# Altium project Project.PrjPCB
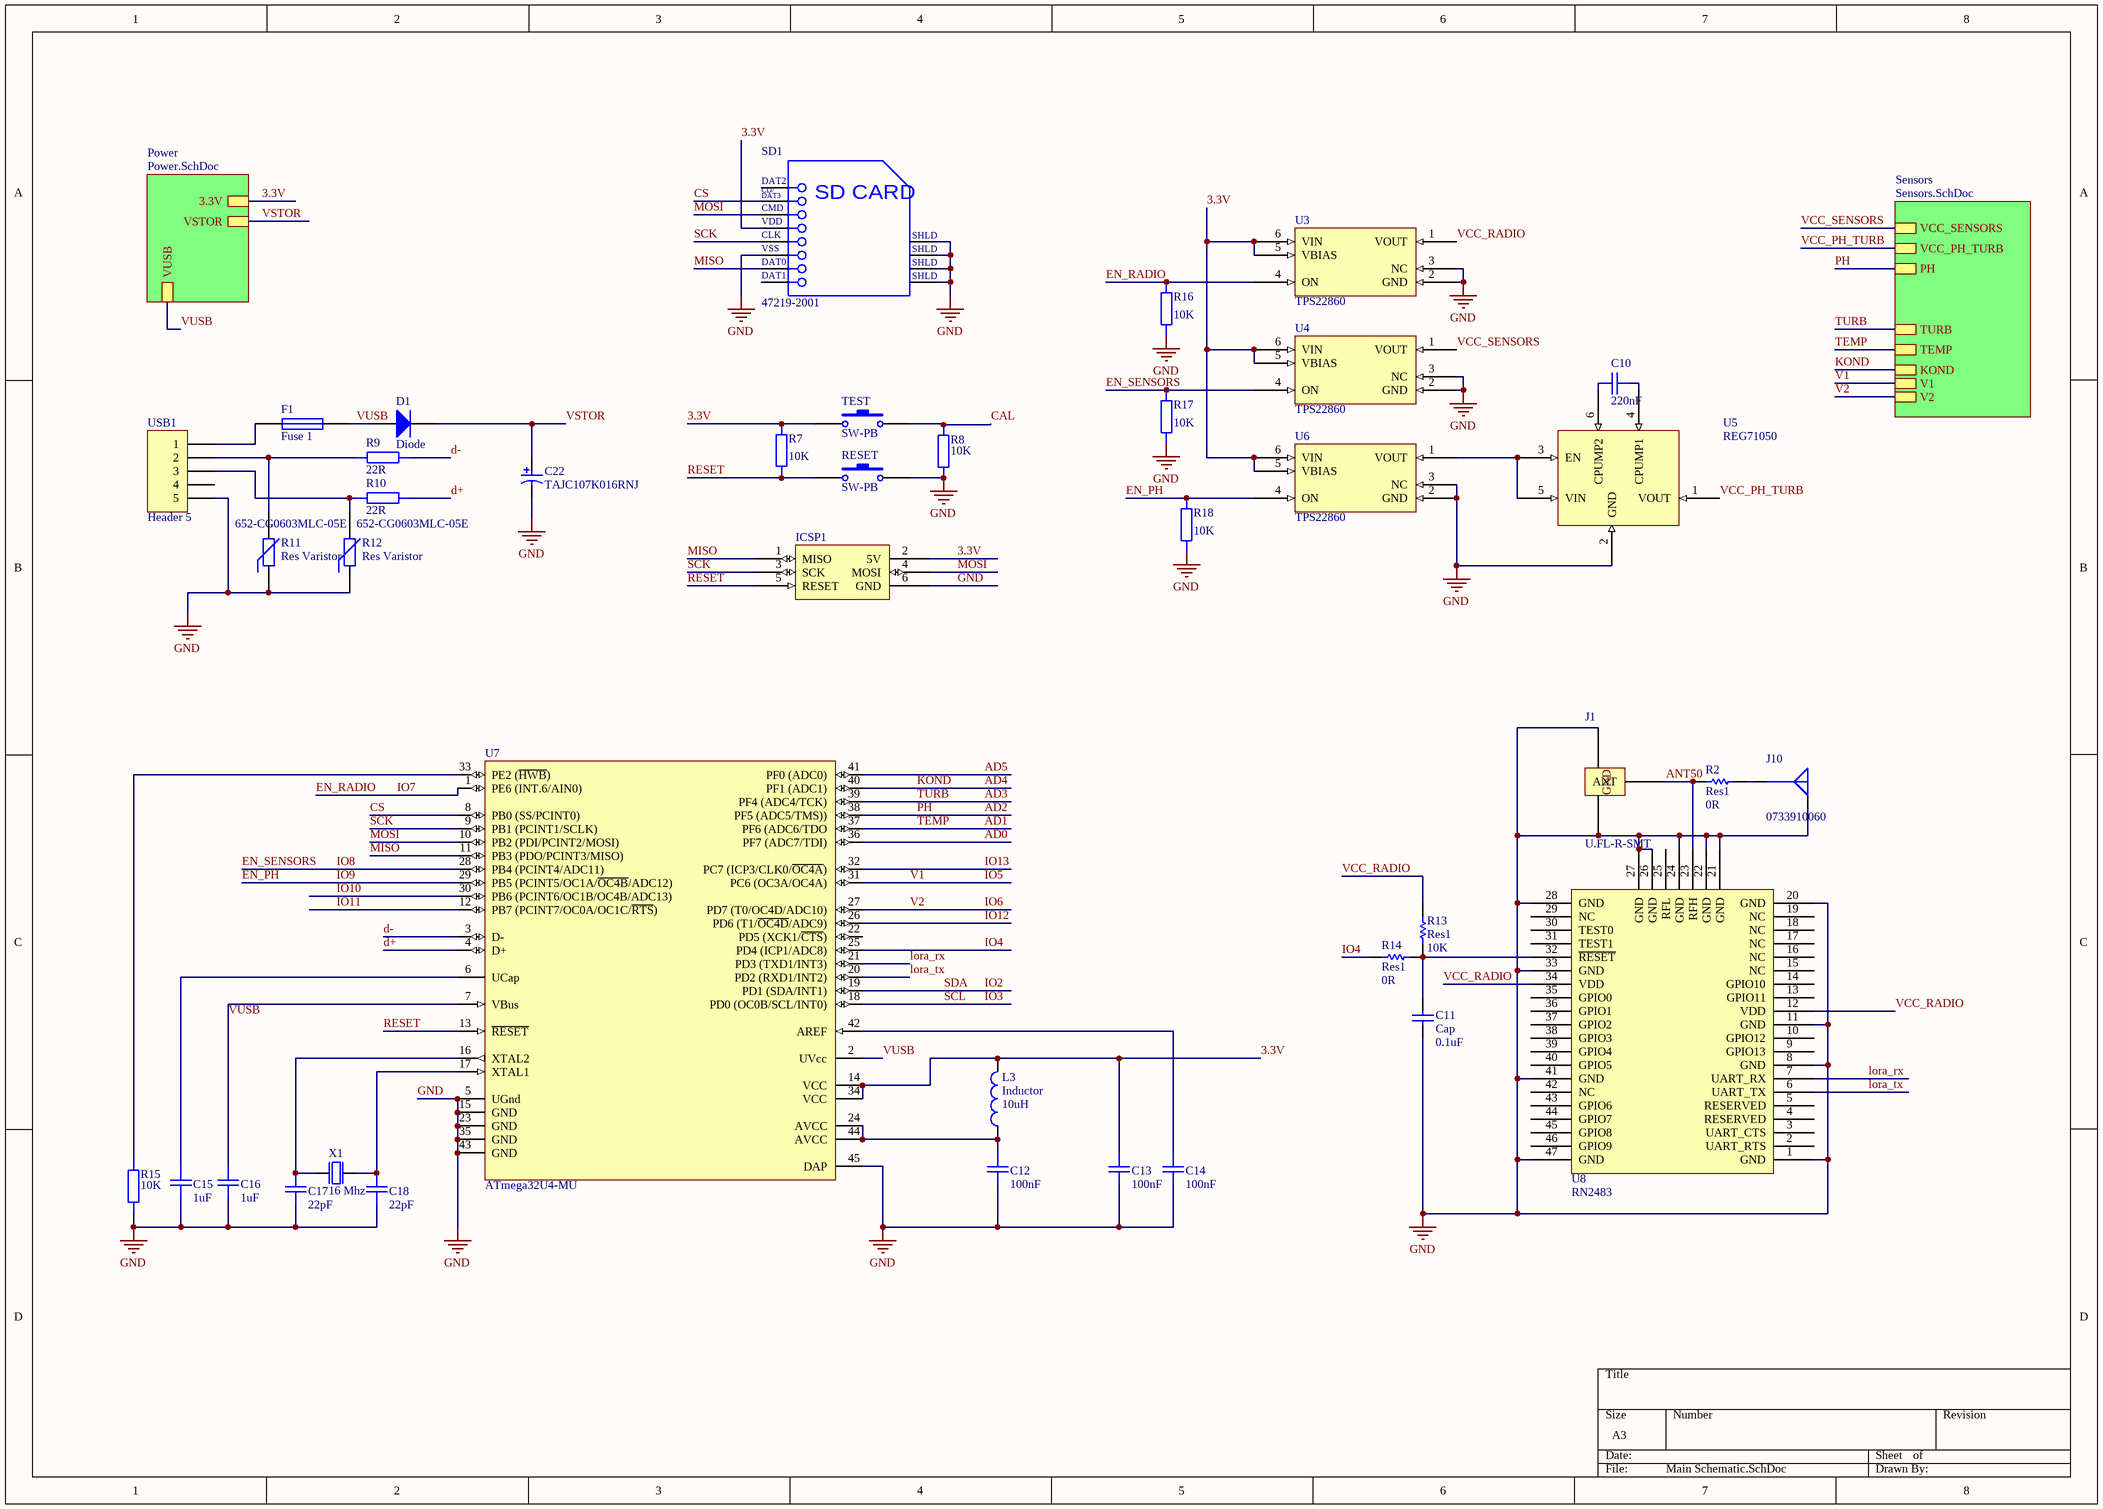
[diagram p0: Main Schematic.SchDoc]
4 sheets, 105 parts. Net scope: hierarchical (ports join the sheet entries above them; power ports are global).
Board files: PCB.PcbDoc, Opamp.PcbDoc
Sheets:
  Main Schematic.SchDoc
    Sensors = Sensors.SchDoc
    Power = Power.SchDoc
  Opamp.SchDoc

## Sheet Main Schematic.SchDoc
size A3

### Parts
C10  value 220nF  [C0805]  (hidden comment: Capacitor)
C11  Cap  value 0.1uF  [C0805]
C12  value 100nF  [C0805]  (hidden comment: Capacitor)
C13  value 100nF  [C0805]  (hidden comment: Capacitor)
C14  value 100nF  [C0805]  (hidden comment: Capacitor)
C15  value 1uF  [C0805]  (hidden comment: Capacitor)
C16  value 1uF  [C0805]  (hidden comment: Capacitor)
C17  value 22pF  [C0805]  (hidden comment: Capacitor)
C18  value 22pF  [C0805]  (hidden comment: Capacitor)
C22  TAJC107K016RNJ  [AVX-TAJ-C-2_M]
D1  Diode  [3216[1206]]
F1  Fuse 1  [1812]
ICSP1  ICSP  [ICSP]  (value not drawn)
J1  U.FL-R-SMT  [U.FL-R-SMT]
J10  0733910060  [MOLEX SD-73391-0060]
L3  Inductor  value 10uH  [C0603]
R2  Res1  value 0R  [6-0805_L]
R7  value 10K  [6-0805_L]  (hidden comment: Resistor)
R8  value 10K  [6-0805_L]  (hidden comment: Resistor)
R9  value 22R  [6-0805_L]  (hidden comment: Resistor)
R10  value 22R  [6-0805_L]  (hidden comment: Resistor)
R11  Res Varistor  Supplier Part Number 1: 652-CG0603MLC-05E  [6-0805_L]
R12  Res Varistor  Supplier Part Number 1: 652-CG0603MLC-05E  [6-0805_L]
R13  Res1  value 10K  [6-0805_L]
R14  Res1  value 0R  [6-0805_L]
R15  value 10K  [6-0805_L]  (hidden comment: Resistor)
R16  value 10K  [6-0805_L]  (hidden comment: Resistor)
R17  value 10K  [6-0805_L]  (hidden comment: Resistor)
R18  value 10K  [6-0805_L]  (hidden comment: Resistor)
RESET  SW-PB  [BUTTON]
SD1  47219-2001  [MOLX-47219-2001-8_V]
TEST  SW-PB  [BUTTON]
U3  TPS22860  [DBV PSOP]
U4  TPS22860  [DBV PSOP]
U5  REG71050  [DBV PSOP]
U6  TPS22860  [DBV PSOP]
U7  ATmega32U4-MU  [TQFP44]
U8  RN2483  [RN2483 - duplicate]
USB1  Header 5  [10118193-0001LF]
X1  16 Mhz  [XTAL CSM-3X]

### Sub-sheets
Power = Power.SchDoc: 3.3V, VUSB, VSTOR
Sensors = Sensors.SchDoc: KOND, PH, VCC_SENSORS, V2, V1, TURB, TEMP, VCC_PH_TURB

### Nets
GND: C11.2 C12.2 C13.2 C14.2 C15.2 C16.2 C17.2 C18.2 C22.2 ICSP1.6(GND) J1.2(GND) J1.3(GND) J10.G R8.2 R11.1 R12.1 R15.2 R16.2 R17.2 R18.2 RESET.2 SD1.6(VSS) SD1.9(SHLD) SD1.10(SHLD) SD1.11(SHLD) SD1.12(SHLD) U3.2(GND) U3.3(NC) U4.2(GND) U4.3(NC) U5.2(GND) U6.2(GND) U6.3(NC) U7.5(UGnd) U7.15(GND) U7.23(GND) U7.35(GND) U7.43(GND) U7.45(DAP) U8.1(GND) U8.8(GND) U8.11(GND) U8.20(GND) U8.21(GND) U8.22(GND) U8.24(GND) U8.26(GND) U8.27(GND) U8.28(GND) U8.33(GND) U8.41(GND) U8.47(GND) USB1.5
3.3V: C13.1 ICSP1.2(5V) L3.1 R7.1 SD1.4(VDD) TEST.1 U3.5(VBIAS) U3.6(VIN) U4.5(VBIAS) U4.6(VIN) U6.5(VBIAS) U6.6(VIN) U7.14(VCC) U7.34(VCC) ; sheet Power/3.3V
AD0: U7.36(PF7_(ADC7/TDI))
AD1: U7.37(PF6_(ADC6/TDO) ; sheet Sensors/TEMP  [also labelled TEMP]
AD2: U7.38(PF5_(ADC5/TMS))) ; sheet Sensors/PH  [also labelled PH]
AD3: U7.39(PF4_(ADC4/TCK)) ; sheet Sensors/TURB  [also labelled TURB]
AD4: U7.40(PF1_(ADC1)) ; sheet Sensors/KOND  [also labelled KOND]
AD5: U7.41(PF0_(ADC0))
ANT50: J1.1(ANT) R2.1 U8.23(RFH)
CAL: R8.1 TEST.2
CS: SD1.2(CD/DAT3) U7.8(PB0_(SS/PCINT0))
d+: R10.2 U7.4(D+)
d-: R9.2 U7.3(D-)
EN_PH: R18.1 U6.4(ON) U7.29(PB5_(PCINT5/OC1A/~{OC4B}/ADC12))  [also labelled IO9]
EN_RADIO: R16.1 U3.4(ON) U7.1(PE6_(INT.6/AIN0))  [also labelled IO7]
EN_SENSORS: R17.1 U4.4(ON) U7.28(PB4_(PCINT4/ADC11))  [also labelled IO8]
IO2: U7.19(PD1_(SDA/INT1))  [also labelled SDA]
IO3: U7.18(PD0_(OC0B/SCL/INT0))  [also labelled SCL]
IO4: R14.1 U7.25(PD4_(ICP1/ADC8))
IO5: U7.31(PC6_(OC3A/OC4A)) ; sheet Sensors/V1  [also labelled V1]
IO6: U7.27(PD7_(T0/OC4D/ADC10)) ; sheet Sensors/V2  [also labelled V2]
IO10: U7.30(PB6_(PCINT6/OC1B/OC4B/ADC13))
IO11: U7.12(PB7_(PCINT7/OC0A/OC1C/~{RTS}))
IO12: U7.26(PD6_(T1/~{OC4D}/ADC9))
IO13: U7.32(PC7_(ICP3/CLK0/~{OC4A}))
lora_rx: U7.21(PD3_(TXD1/INT3)) U8.7(UART_RX)
lora_tx: U7.20(PD2_(RXD1/INT2)) U8.6(UART_TX)
MISO: ICSP1.1(MISO) SD1.7(DAT0) U7.11(PB3_(PDO/PCINT3/MISO))
MOSI: ICSP1.4(MOSI) SD1.3(CMD) U7.10(PB2_(PDI/PCINT2/MOSI))
RESET: ICSP1.5(RESET) R7.2 RESET.1 U7.13(~{RESET})
SCK: ICSP1.3(SCK) SD1.5(CLK) U7.9(PB1_(PCINT1/SCLK))
VCC_PH_TURB: U5.1(VOUT) ; sheet Sensors/VCC_PH_TURB
VCC_RADIO: R13.1 U3.1(VOUT) U8.12(VDD) U8.34(VDD)
VCC_SENSORS: U4.1(VOUT) ; sheet Sensors/VCC_SENSORS
VSTOR: C22.1 D1.2(K) ; sheet Power/VSTOR
VUSB: C16.1 D1.1(A) F1.2 U7.2(UVcc) U7.7(VBus) ; sheet Power/VUSB  [project net ~{EN}]
NetC10_1: C10.1 U5.6(CPUMP2)
NetC10_2: C10.2 U5.4(CPUMP1)
NetC11_1: C11.1 R13.2 R14.2 U8.32(~{RESET})
NetC12_1: C12.1 L3.2 U7.24(AVCC) U7.44(AVCC)
NetC14_1: C14.1 U7.42(AREF)
NetC15_1: C15.1 U7.6(UCap)
NetC17_1: C17.1 U7.16(XTAL2) X1.1(inp)
NetC18_1: C18.1 U7.17(XTAL1) X1.2(out)
NetF1_1: F1.1 USB1.1
NetJ10_S: J10.S R2.2
NetR9_1: R9.1 R11.2 USB1.2
NetR10_1: R10.1 R12.2 USB1.3
NetR15_1: R15.1 U7.33(PE2_(~{HWB}))
NetU5_3: U5.3(EN) U5.5(VIN) U6.1(VOUT)

Not connected (* = marked no-connect by the designer): SD1 1(DAT2) 8(DAT1); U7 22(PD5_(XCK1/~{CTS})); U8 2(UART_RTS) 3(UART_CTS) 4(RESERVED) 5(RESERVED) 9(GPIO13) 10(GPIO12) 13(GPIO11) 14(GPIO10) 15(NC) 16(NC) 17(NC) 18(NC) 19(NC) 25(RFL) 29(NC) 30(TEST0) 31(TEST1) 35(GPIO0) 36(GPIO1) 37(GPIO2) 38(GPIO3) 39(GPIO4) 40(GPIO5) 42(NC) 43(GPIO6) 44(GPIO7) 45(GPIO8) 46(GPIO9); USB1 4

### Notes on the sheet
- (in symbol CMP-2000-05245-1) CD/; DAT3; SD CARD

### Library data of the parts
C10 C12-C18 = Capacitor: Voltage: 16V; Tolerance: 10%; Package: 0603
C11 = Cap: Capacitor; Published: 8-Jun-2000; LatestRevisionDate: 17-Jul-2002; LatestRevisionNote: Re-released for DXP Platform.; PackageReference: RAD-0.3; Publisher: Altium Limited; PackageDescription: Radial Cap, Thru-Hole; 2 Leads; 0.3 in Pin Spacing
C22 = CMP-2100-03691-1: Standard Tantalum, 100 uF, +/- 10%, 16 V, -55 to 125 degC, 2-Pin SMD (2312), RoHS, Tape and Reel; Manufacturer: AVX; Resistance: 1Ohm; Dissipation Factor: 8%; Voltage Rating: 16V; Polarity: Polar; Capacitance: 100uF; Leakage Current: 16uA; Datasheet URL: http://datasheets.avx.com/TAJ.pdf; Package Description: 2-Pin Surface Mount Device, Body 6 x 3.25 mm; Case/Package: Molded; Case Code (Metric): 6032; Number of Pins: 2; Tolerance: 10%; Length: 6mm; Width: 3.2mm; Height: 2.8mm; Height - Seated (Max): 0.11inch; Min Operating Temperature: -55degC; Termination: SMD/SMT; Voltage Rating (DC): 16V; Max Operating Temperature: 125degC; Package Quantity: 1; Manufacturer URL: http://www.avx.com/; RoHSCompliant: True; ESR (Equivalent Series Resistance): 1Ohm; Packaging: TapeandReel; Radiation Hardening: No; Lead Free: LeadFree; Case Code (Imperial): 2412; Depth: 3.2mm; Datasheet Version: 42401.0; Package Reference: TAJ-C-2; REACH SVHC: NoSVHC
D1 = Diode: Default Diode; Published: 8-Jun-2000; LatestRevisionDate: 17-Jul-2002; LatestRevisionNote: Re-released for DXP Platform.; PackageVersion: Sep-1996; PackageReference: SMC; Publisher: Altium Limited; PackageDescription: DO-214-AB/SMC; 2 C-Bend Leads; Body 7.9 x 5.9 mm, inc. leads (LxW); Code_JEDEC: DO-214-AB
F1 = Fuse 1: Fuse; Published: 8-Jun-2000; LatestRevisionDate: 17-Jul-2002; LatestRevisionNote: Re-released for DXP Platform.; PackageReference: PIN-W2/E2.8; Publisher: Altium Limited; PackageDescription: Thru-Hole; 2 Leads
J10 = 0733910060: CONN SMA JACK STR 50 OHM PCB; Part Number: 0733910060
L3 = Inductor: Code_IEC: 1005; Published: 8-Jun-2000; LatestRevisionDate: 29-May-2009; LatestRevisionNote: IPC-7351 Footprint Added.; PackageReference: 0402-A; Publisher: Altium Limited; PackageDescription: Chip Inductor; Code_JEITA: 0402
R2 R13 R14 = Res1: Resistor; Published: 8-Jun-2000; LatestRevisionDate: 17-Jul-2002; LatestRevisionNote: Re-released for DXP Platform.; PackageReference: AXIAL-0.3; Publisher: Altium Limited; PackageDescription: Axial Device, Thru-Hole; 2 Leads; 0.3 in Pin Spacing
R7-R10 R15-R18 = Resistor: Tolerance: 1%; Power Rating: 1/4W; Package: 0602
R11 R12 = Res Varistor: Varistor (Voltage-Sensitive Resistor); Manufacturer: Bourns; Manufacturer Part Number: CG0603MLC-05E; Capacitance: 0.5pF; Voltage Rating (DC): 5V; Voltage Rating (AC): 8V; Number of Channels: 1; Clamping Voltage: 20V; Current Rating: 50nA; Turn-On Delay Time: 1ns; Element Configuration: Single; Published: 24-Mar-1999; LatestRevisionDate: 29-May-2009; LatestRevisionNote: IPC-7351 Footprint Added.; PackageVersion: Mar-2003; PackageReference: 6-0805; Publisher: Altium Limited; PackageDescription: Chip Resistor 0805 Case Size; Code_IPC: RESC2012; Supplier 1: Mouser; Stock 1: 88623; Pricing 1: 1=0.51, 10=0.294, 50=0.294, 100=0.171, 1000=0.107, 10000=0.08 (USD); Case/Package: 0603; Number of Pins: 2; Case Code (Imperial): 0603; Case Code (Metric): 1608; Contact Plating: Tin; Min Operating Temperature: -40°C; Max Operating Temperature: 85°C; Operating Supply Voltage: 5V; Package Quantity: 1; Packaging: Tape and Reel; Termination: SMD/SMT; Voltage: 5V; Number of Circuits: 1; Max Voltage Rating (DC): 5V; Working Voltage: 5V; Leakage Current: 50nA; Length: 1.6mm; Width: 0.8mm; Depth: 0.8mm; Thickness: 0.8mm; Radiation Hardening: No; REACH SVHC: No SVHC; ComponentLink1URL: https://www.bourns.com/docs/Product-Datasheets/MLC.pdf; ComponentLink1Description: https://www.bourns.com/docs/Product-Datasheets/MLC.pdf; ComponentLink2URL: http://www.farnell.com/datasheets/1785244.pdf; ComponentLink2Description: http://www.farnell.com/datasheets/1785244.pdf; ComponentLink3URL: http://www.jameco.com/Jameco/Products/ProdDS/1163231.pdf; ComponentLink3Description: http://www.jameco.com/Jameco/Products/ProdDS/1163231.pdf; ComponentLink4URL: http://www.bourns.com/docs/Product-Datasheets/MLC.pdf; ComponentLink4Description: http://www.bourns.com/docs/Product-Datasheets/MLC.pdf
RESET TEST = SW-PB: Switch; Published: 24-Mar-1999; LatestRevisionDate: 17-Jul-2002; LatestRevisionNote: Re-released for DXP Platform.; PackageReference: SPST-2; Publisher: Altium Limited; PackageDescription: Switch; 2 Leads
SD1 = CMP-2000-05245-1: MicroSD Card Connector, Hinge Type, -40 to 85 degC, 8-Pin SMD, RoHS, Tape and Reel; Manufacturer: Molex; Current Rating: 500mA; Number of Contacts: 8; Pitch: 1.09mm; Insertion - Extraction Style: Hinged; Voltage Rating: 100VDC; Product: CardConnectors; Contact Material: CopperAlloy; Series: 47219; Packaging: Reel; Brand: Molex; Product Category: MemoryCardConnectors; Housing Material: Thermoplastic; Mounting Style: SMD/SMT; Termination Style: SMD; Datasheet Version: Rev. F, 06/2009; Card Type: microSD; Manufacturer URL: http://www.molex.com/; RoHS: Details; Datasheet URL: http://www.molex.com/pdm_docs/sd/472192001_sd.pdf; Factory Pack Quantity: 2400
U3 U4 U6 = TPS22860: Load switch; ComponentLink1Description: datasheet; ComponentLink1URL: http://www.ti.com/lit/ds/symlink/tps22860.pdf
U5 = REG71050: Reguator 5V
U7 = ATmega32U4-MU: 8-bit AVR Microcontroller, 2.7-5.5V, 32KB Flash, 2.5KB EEPROM, 1KB SRAM, USB Controller, 44-pin QFN, Industrial Grade (-40°C to 85°C); pin to pad: 45>43; Published: 1-Apr-2010; DatasheetVersion: revD, Jan-2009; PackageVersion: revF, Jul-2007; PackageReference: 44PW; Publisher: Altium Limited; PackageDescription: 44-Pin Quad Flat No-Lead Package, 7 x 7 mm Body, 0.5 mm Pitch (QFN); Supplier 1: Digi-Key; Supplier Part Number 1: ATMEGA32U4-MU-ND; Supplier 2: Mouser; Supplier Part Number 2: 556-ATMEGA32U4-MU; Code_JEDEC: MO-220-VKKD-1; ComponentLink1Description: Manufacturer Link; ComponentLink1URL: http://www.atmel.com/products/avr/default.asp?; ComponentLink2Description: ATmega16U4/32U4 Datasheet; ComponentLink2URL: http://www.atmel.com/dyn/resources/prod_documents/doc7766.pdf; ComponentLink3Description: ATmega16U4 ATmega32U4 Summary; ComponentLink3URL: http://www.atmel.com/dyn/resources/prod_documents/7766S.pdf; ComponentLink4Description: Atmel.com Home; ComponentLink4URL: http://www.atmel.com
USB1 = Header 5: Header, 5-Pin; LatestRevisionDate: 17-Jul-2002; LatestRevisionNote: Re-released for DXP Platform.; Publisher: Altium Limited
X1 = NX2520SA-16MHZ-STD-CSW-5: XTAL SMD 2520, 16MHz, 8pF, ±15ppm; Manufacturer: NDK; Value: 8MHz; Note: XTAL SMD 16.000MHz; Artikkelnr Noca: 22019192; Artikkelnr Simpro: N.A.; Part Number: NX2520SA-16MHZ-STD-CSW-5; Manufacturer Part Number: NX2520SA-16MHZ-STD-CSW-5; Datasheet: http://www.ndk.com/images/products/catalog/c_NX2520SA-STD-CSW-5_e.pdf; LatestRevisionDate: 2012-06-15; Pin Count: 4; Publisher: Nordic Semiconductor; Published: 2012-06-15; Supplier: Digi-Key; Supplier part number: 644-1169-1-ND; 2nd source Supplier: *; 2nd source part number: *; Footprint Doc: BT-XTAL_2520

## Sheet Sensors.SchDoc
size A4
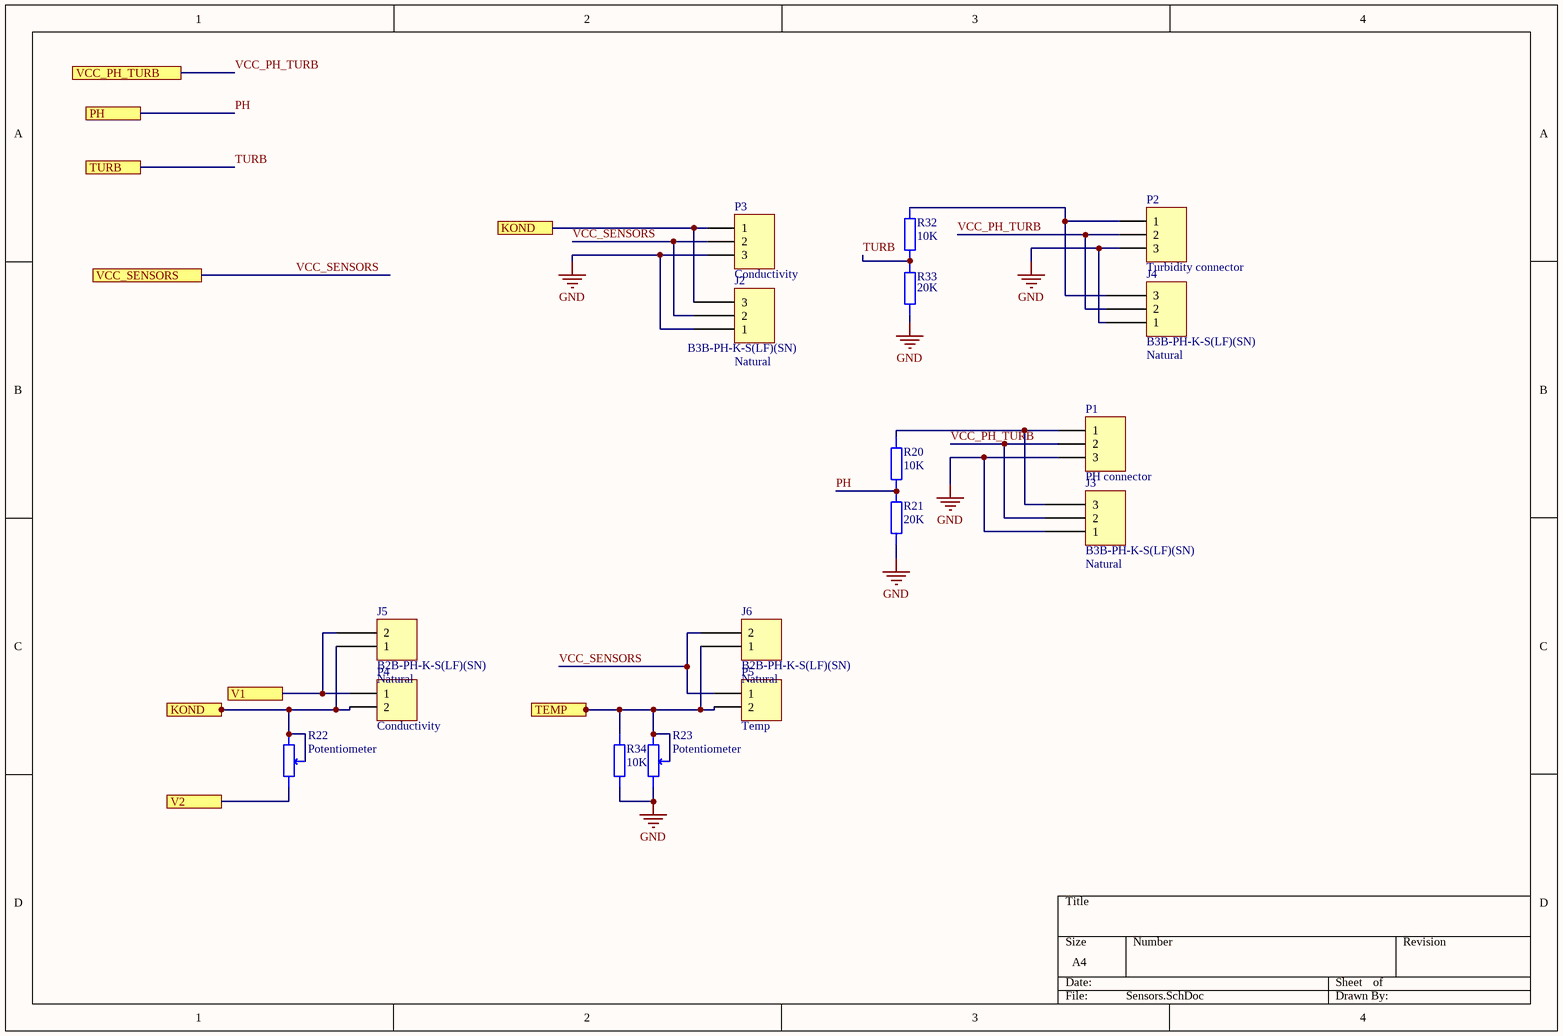
[diagram p1: Sensors.SchDoc]

### Parts
J2  B3B-PH-K-S(LF)(SN)  Colour: Natural  [JST B3B-PH-K]
J3  B3B-PH-K-S(LF)(SN)  Colour: Natural  [JST B3B-PH-K]
J4  B3B-PH-K-S(LF)(SN)  Colour: Natural  [JST B3B-PH-K]
J5  B2B-PH-K-S(LF)(SN)  Colour: Natural  [JST B2B-PH-K]
J6  B2B-PH-K-S(LF)(SN)  Colour: Natural  [JST B2B-PH-K]
P1  PH connector  [HDR1X3]
P2  Turbidity connector  [HDR1X3]
P3  Conductivity  [HDR1X3]
P4  Conductivity  [HDR1X2]
P5  Temp  [HDR1X2]
R20  value 10K  [6-0805_L]  (hidden comment: Resistor)
R21  value 20K  [6-0805_L]  (hidden comment: Resistor)
R22  Potentiometer  [Trimmer]
R23  Potentiometer  [Trimmer]
R32  value 10K  [6-0805_L]  (hidden comment: Resistor)
R33  value 20K  [6-0805_L]  (hidden comment: Resistor)
R34  value 10K  [6-0805_L]  (hidden comment: Resistor)

### Ports
KOND, PH, TEMP, TURB, V1, V2, VCC_PH_TURB, VCC_SENSORS

### Nets
GND: J2.1 J3.1 J4.1 P1.3 P2.3 P3.3 R21.2 R23.2 R33.2 R34.2
AD1: J6.1 P5.2 R23.1 R23.3 R34.1 ; port TEMP
AD4: J2.3 J5.1 P3.1 P4.2 R22.1 R22.3 ; port KOND
IO5: J5.2 P4.1 ; port V1
IO6: R22.2 ; port V2
PH: R20.2 R21.1 ; port PH  [project net AD2]
TURB: R32.2 R33.1 ; port TURB  [project net AD3]
VCC_PH_TURB: J3.2 J4.2 P1.2 P2.2 ; port VCC_PH_TURB
VCC_SENSORS: J2.2 J6.2 P3.2 P5.1 ; port VCC_SENSORS
NetJ3_3: J3.3 P1.1 R20.1
NetJ4_3: J4.3 P2.1 R32.1

### Library data of the parts
J2-J4 = B3B-PH-K-S(LF)(SN): CONN HEADER PH TOP 3POS 2MM; Manufacturer: JST Sales America Inc.; Pitch: 0.079" (2.00mm); Number Of Positions: 3; Part Number: B3B-PH-K-S(LF)(SN); PartId: 29448; Supplier 1: Digi-Key; Supplier Part Number 1: 455-1705-ND; ComponentLink1Description: Datasheet; ComponentLink1URL: http://www.jst-mfg.com/product/pdf/eng/ePH.pdf; ComponentLink2Description: Digi-Key Listing; ComponentLink2URL: http://www.digikey.com/product-detail/en/jst-sales-america-inc/B3B-PH-K-S(LF)(SN)/455-1705-ND/926612; Price: 0,19; Type: Header, Shrouded; Contact Finish: Tin; Fastening Type: Detent Lock; Number Of Rows: 1; Series: PH
J5 J6 = B2B-PH-K-S(LF)(SN): CONN HEADER PH TOP 2POS 2MM; Manufacturer: JST Sales America Inc.; Pitch: 0.079" (2.00mm); Number Of Positions: 2; Part Number: B2B-PH-K-S(LF)(SN); PartId: 29447; Supplier 1: Digi-Key; Supplier Part Number 1: 455-1704-ND; ComponentLink1Description: Datasheet; ComponentLink1URL: http://www.jst-mfg.com/product/pdf/eng/ePH.pdf; ComponentLink2Description: Digi-Key Listing; ComponentLink2URL: http://www.digikey.com/product-detail/en/jst-sales-america-inc/B2B-PH-K-S(LF)(SN)/455-1704-ND/926611; Price: 0,17; Type: Header, Shrouded; Contact Finish: Tin; Fastening Type: Detent Lock; Number Of Rows: 1; Series: PH
P1-P3 = Header 3: Header, 3-Pin; LatestRevisionDate: 17-Jul-2002; LatestRevisionNote: Re-released for DXP Platform.; Publisher: Altium Limited
P4 P5 = Header 2: Header, 2-Pin; LatestRevisionDate: 17-Jul-2002; LatestRevisionNote: Re-released for DXP Platform.; Publisher: Altium Limited
R20 R21 R32-R34 = Resistor: Tolerance: 1%; Power Rating: 1/4W; Package: 0602

## Sheet Power.SchDoc
size A3
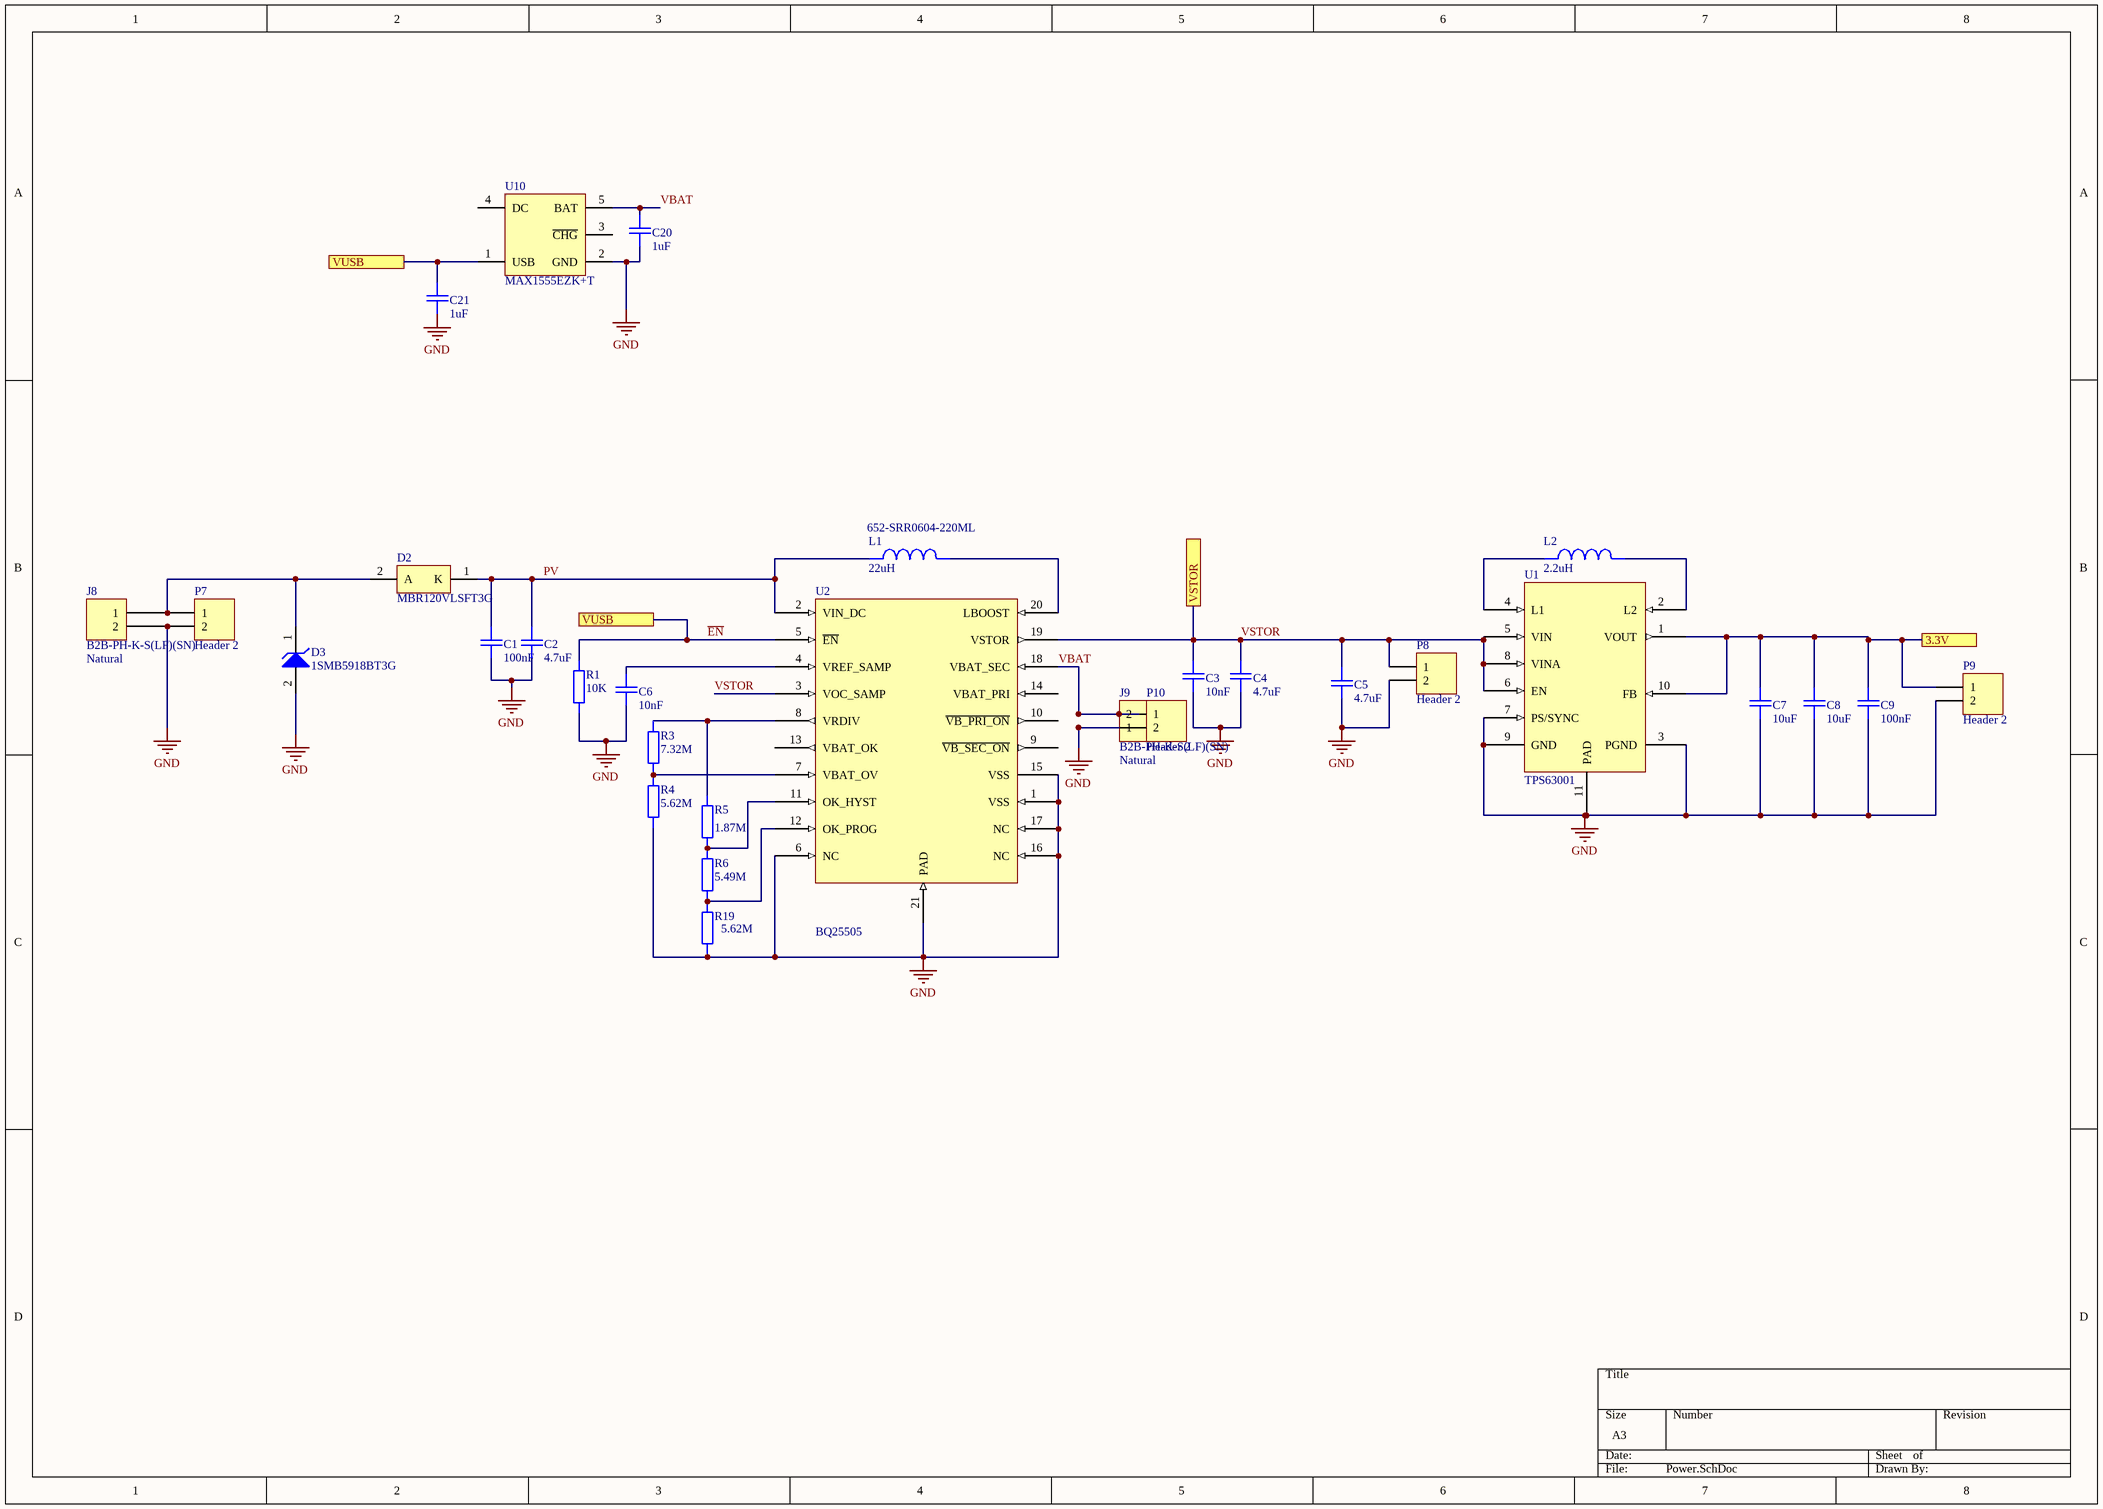
[diagram p2: Power.SchDoc]

### Parts
C1  value 100nF  [C0805]  (hidden comment: Capacitor)
C2  value 4.7uF  [C0805]  (hidden comment: Capacitor)
C3  value 10nF  [C0805]  (hidden comment: Capacitor)
C4  value 4.7uF  [C0805]  (hidden comment: Capacitor)
C5  value 4.7uF  [C0805]  (hidden comment: Capacitor)
C6  value 10nF  [C0805]  (hidden comment: Capacitor)
C7  value 10uF  [C0805]  (hidden comment: Capacitor)
C8  value 10uF  [C0805]  (hidden comment: Capacitor)
C9  value 100nF  [C0805]  (hidden comment: Capacitor)
C20  value 1uF  [C0805]  (hidden comment: Capacitor)
C21  value 1uF  [C0805]  (hidden comment: Capacitor)
D2  MBR120VLSFT3G  [ONSC-SOD-123FL-2-498-01_V]
D3  1SMB5918BT3G  [ONSC-SMB-2-403A-03_H_V]
J8  B2B-PH-K-S(LF)(SN)  Colour: Natural  [JST B2B-PH-K]
J9  B2B-PH-K-S(LF)(SN)  Colour: Natural  [JST B2B-PH-K]
L1  value 22uH  Supplier Part Number 1: 652-SRR0604-220ML  [SRR0604]  (hidden comment: Inductor)
L2  value 2.2uH  [MLP2520]  (hidden comment: Inductor)
P7  Header 2  [HDR1X2]
P8  Header 2  [HDR1X2]
P9  Header 2  [HDR1X2]
P10  Header 2  [HDR1X2]
R1  value 10K  [6-0805_L]  (hidden comment: Resistor)
R3  value 7.32M  [6-0805_L]  (hidden comment: Resistor)
R4  value 5.62M  [6-0805_L]  (hidden comment: Resistor)
R5  value 1.87M  [6-0805_L]  (hidden comment: Resistor)
R6  value 5.49M  [6-0805_L]  (hidden comment: Resistor)
R19  value 5.62M  [6-0805_L]  (hidden comment: Resistor)
U1  TPS63001  [DRC0010J]
U2  BQ25505  [S-PVQFN-N20]
U10  MAX1555EZK+T  [MAXM-Z5+1_N]

### Ports
3.3V, VSTOR, VUSB

### Nets
GND: C1.2 C2.2 C3.2 C4.2 C5.2 C6.2 C7.2 C8.2 C9.2 C20.2 C21.2 D3.2(A) J8.2 J9.1 P7.2 P8.2 P9.2 P10.2 R1.2 R4.2 R19.2 U1.3(PGND) U1.7(PS/SYNC) U1.9(GND) U1.11(PAD) U2.1(VSS) U2.6(NC) U2.15(VSS) U2.16(NC) U2.17(NC) U2.21(PAD) U10.2(GND)
3.3V: C7.1 C8.1 C9.1 P9.1 U1.1(VOUT) U1.10(FB) ; port 3.3V
~{EN}: C21.1 R1.1 U2.5(~{EN}) U10.1(USB) ; port VUSB
PV: C1.1 C2.1 D2.1(K) L1.1 U2.2(VIN_DC)
VBAT: C20.1 J9.2 P10.1 U2.18(VBAT_SEC) U10.5(BAT)
VSTOR: C3.1 C4.1 C5.1 P8.1 U1.5(VIN) U1.6(EN) U1.8(VINA) U2.3(VOC_SAMP) U2.19(VSTOR) ; port VSTOR
NetC6_1: C6.1 U2.4(VREF_SAMP)
NetD2_2: D2.2(A) D3.1(K) J8.1 P7.1
NetL1_2: L1.2 U2.20(LBOOST)
NetL2_1: L2.1 U1.4(L1)
NetL2_2: L2.2 U1.2(L2)
NetR3_1: R3.1 R5.1 U2.8(VRDIV)
NetR3_2: R3.2 R4.1 U2.7(VBAT_OV)
NetR5_2: R5.2 R6.1 U2.11(OK_HYST)
NetR6_2: R6.2 R19.1 U2.12(OK_PROG)

Not connected (* = marked no-connect by the designer): U2 9(~{VB_SEC_ON}) 10(~{VB_PRI_ON}) 13(VBAT_OK) 14(VBAT_PRI); U10 3(~{CHG}) 4(DC)

### Library data of the parts
C1-C9 C20 C21 = Capacitor: Voltage: 16V; Tolerance: 10%; Package: 0603
D2 = CMP-1055-00447-1: Schottky Power Rectifier, 2-Pin SOD-123, Pb-Free, Tape and Reel; Manufacturer: On Semiconductor; Configuration: Single; IFSM Max (A): 45; ComponentLink2URL: http://www.onsemi.cn/pub_link/Collateral/MBR120VLSFT1-D.PDF; PartNumber: MBR120VLSFT3G; DatasheetVersion: Rev. 2; PackageVersion: Rev. A; PackageDescription: 2-Pin SOD, Body 1.65 x 2.7 mm; ComponentLink1URL: http://www.onsemi.com/; ComponentLink3URL: http://www.onsemi.cn/pub_link/Collateral/MBR120VLSFT1-D.PDF; Packing: Tape and Reel; Mounting Technology: Surface Mount; ComponentLink1Description: Manufacturer URL; ComponentLink3Description: Package Specification; ComponentLink2Description: Datasheet; PackageReference: SOD-123FL-2-498-01; RoHS: TRUE
D3 = CMP-1060-00206-1: 3 W Zener Voltage Regulator, 2-Pin SMB, Pb-Free, Tape and Reel; Manufacturer: On Semiconductor; VZ Typ (V): 5.1; ComponentLink3URL: http://www.onsemi.com/pub_link/Collateral/1SMB5913BT3-D.PDF; Mounting Technology: Surface Mount; Packing: Tape and Reel; ComponentLink3Description: Package Specification; ComponentLink2URL: http://www.onsemi.com/pub_link/Collateral/1SMB5913BT3-D.PDF; DatasheetVersion: Rev. 8; PackageReference: SMB-2-403A-03_H; ComponentLink2Description: Datasheet; ComponentLink1Description: Manufacturer URL; ComponentLink1URL: http://www.onsemi.com/; RoHS: Pb-Free; PackageDescription: 2-Pin Small Molded Package, J-Bend Lead, Body 4.33 x 3.625 mm; PartNumber: 1SMB5918BT3G; PackageVersion: Rev. H, 05/2011
J8 J9 = B2B-PH-K-S(LF)(SN): as J5 on sheet Sensors; Part Number: B2B-PH-K-S(LF)(SN); PartId: 29447; Supplier 1: Digi-Key; Supplier Part Number 1: 455-1704-ND; ComponentLink1Description: Datasheet; ComponentLink1URL: http://www.jst-mfg.com/product/pdf/eng/ePH.pdf; ComponentLink2Description: Digi-Key Listing; ComponentLink2URL: http://www.digikey.com/product-detail/en/jst-sales-america-inc/B2B-PH-K-S(LF)(SN)/455-1704-ND/926611; Price: 0,17; Type: Header, Shrouded; Contact Finish: Tin; Fastening Type: Detent Lock; Number Of Rows: 1; Series: PH
L1 = Inductor: Manufacturer: Bourns; Core Material: Ferrite; Material: Steel; Tolerance: 20%; Max DC Current: 900mA; DC Resistance (DCR): 190mR; Self Resonant Frequency: 25MHz; Q Factor: 16; Shielding: Shielded; Saturation Current: 1.2A; Test Frequency: 1kHz; Supplier 1: Mouser; Stock 1: 4936; Pricing 1: 1=0.71, 10=0.658, 50=0.658, 100=0.476, 1000=0.365, 10000=0.365 (USD); Mount: Surface Mount; Case/Package: 0604; Min Operating Temperature: -40°C; Max Operating Temperature: 125°C; Inductance: 22uh; Packaging: Tape and Reel; Package Quantity: 1000; Inductance Tolerance: 20%; Current Rating: 900mA; Frequency: 25MHz; Resistance: 190MR; Termination: SMD/SMT; Composition: Wirewound; DC Current: 900mA; Military Standard: Not; RMS Current (Irms): 900mA; Length: 6.5mm; Height: 4.8mm; Width: 6.5mm; Height - Seated (Max): 0.189inch; Depth: 6.7mm; REACH SVHC: No SVHC; ComponentLink1URL: http://uk.rs-online.com/webdocs/0fa5/0900766b80fa5950.pdf; ComponentLink1Description: http://uk.rs-online.com/webdocs/0fa5/0900766b80fa5950.pdf; ComponentLink2URL: https://www.alliedelec.com/m/d/db85a2264958f44ba0f102d64e276dc0.pdf; ComponentLink2Description: https://www.alliedelec.com/m/d/db85a2264958f44ba0f102d64e276dc0.pdf; ComponentLink3URL: http://www.bourns.com/docs/Product-Datasheets/SRR0604.pdf; ComponentLink3Description: http://www.bourns.com/docs/Product-Datasheets/SRR0604.pdf; ComponentLink4URL: https://www.bourns.com/docs/Product-Datasheets/SRR0604.pdf; ComponentLink4Description: https://www.bourns.com/docs/Product-Datasheets/SRR0604.pdf; ComponentLink5URL: http://www.farnell.com/datasheets/1723201.pdf; ComponentLink5Description: http://www.farnell.com/datasheets/1723201.pdf; ComponentLink6URL: http://components.arrow.com/part/dataview/41632166S7459348N1506; ComponentLink6Description: http://components.arrow.com/part/dataview/41632166S7459348N1506; ComponentLink7URL: http://www.bourns.com/pdfs/SRR0604.pdf; ComponentLink7Description: http://www.bourns.com/pdfs/SRR0604.pdf
P7-P10 = Header 2: Header, 2-Pin; LatestRevisionDate: 17-Jul-2002; LatestRevisionNote: Re-released for DXP Platform.; Publisher: Altium Limited
R1 R3-R6 R19 = Resistor: Tolerance: 1%; Power Rating: 1/4W; Package: 0602
U10 = CMP-0246-00648-1: Dual-Input USB/AC Adapter 1-Cell Li+ Battery Charger, 4.2 V Charger Voltage, 0.28 A DC Charging Current, 5-Pin TSOT Package, RoHS, Tape and Reel; Manufacturer: Maxim; Max Protected VIN (V): 7; ICHG Typ: 0.28 A; Lithium Ion Cells: 1; Charger (V): 4.2; ComponentLink3URL: http://pdfserv.maximintegrated.com/package_dwgs/21-0113.PDF; PackageDescription: 5-Pin Thin SOT23, Body 2.9 x 1.6 mm, Pitch 0.95 mm; Max Charging VIN (V): 7; Packing: Tape and Reel; PackageReference: Z5+1; ComponentLink3Description: Package Specification; ComponentLink1Description: Manufacturer URL; Package: TSOT; Operating Temperature Range: -40 to 85 degC; RoHS: TRUE; Mounting Technology: Surface Mount; PartNumber: MAX1555EZK+T; DatasheetVersion: Rev. 0; ComponentLink2Description: Datasheet; ComponentLink2URL: http://datasheets.maximintegrated.com/en/ds/MAX1551-MAX1555.pdf; PackageVersion: Rev. D; ComponentLink1URL: http://www.maximintegrated.com/
U1 = TPS63001: ComponentLink1Description: datasheet; ComponentLink1URL: http://www.ti.com/lit/ds/symlink/tps63001.pdf
U2 = BQ25505: ComponentLink1Description: datasheet; ComponentLink1URL: http://www.ti.com/lit/ds/symlink/bq25505.pdf

## Sheet Opamp.SchDoc
size A4
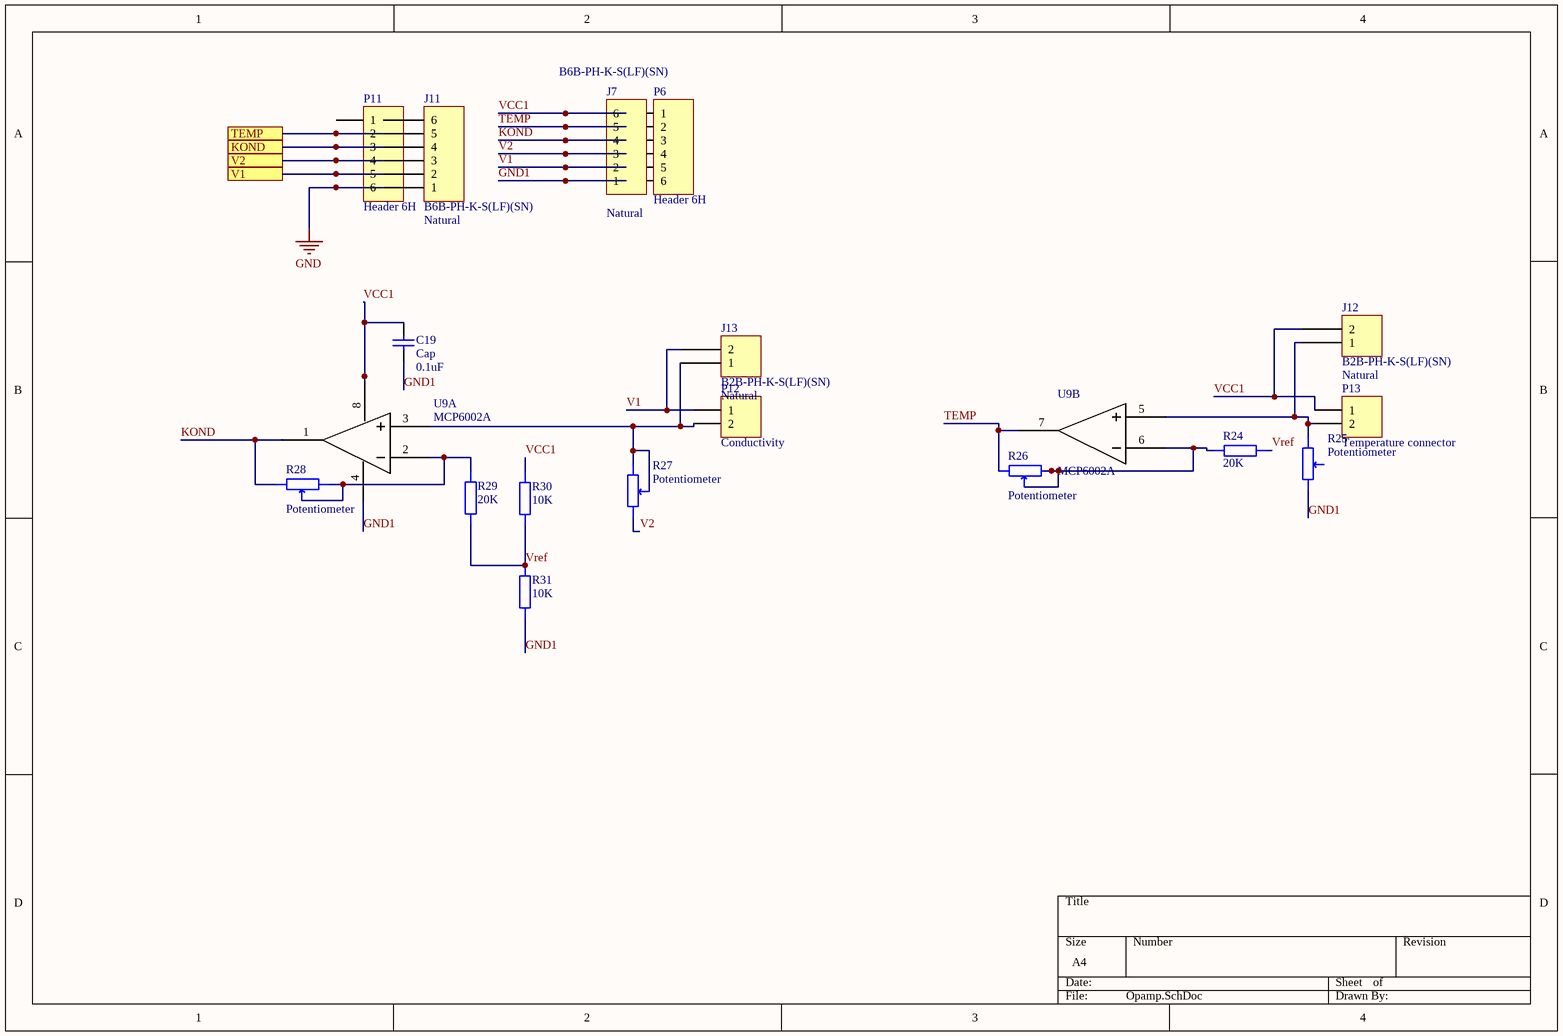
[diagram p3: Opamp.SchDoc]

### Parts
C19  Cap  value 0.1uF  [C0805]
J7  B6B-PH-K-S(LF)(SN)  Colour: Natural  [JST B6B-PH-K]
J11  B6B-PH-K-S(LF)(SN)  Colour: Natural  [JST B6B-PH-K]
J12  B2B-PH-K-S(LF)(SN)  Colour: Natural  [JST B2B-PH-K]
J13  B2B-PH-K-S(LF)(SN)  Colour: Natural  [JST B2B-PH-K]
P6  Header 6H  [HDR1X6]
P11  Header 6H  [HDR1X6H]
P12  Conductivity  [HDR1X2]
P13  Temperature connector  [HDR1X2]
R24  value 20K  [6-0805_L]  (hidden comment: Resistor)
R25  Potentiometer  [Trimmer]
R26  Potentiometer  [Trimmer]
R27  Potentiometer  [Trimmer]
R28  Potentiometer  [Trimmer]
R29  value 20K  [6-0805_L]  (hidden comment: Resistor)
R30  value 10K  [6-0805_L]  (hidden comment: Resistor)
R31  value 10K  [6-0805_L]  (hidden comment: Resistor)
U9  MCP6002A  [SOIC127P600-8N]  (parts A,B of 2)

### Ports
KOND, TEMP, V1, V2

### Nets
GND: J11.1 P11.6
GND1: C19.2 J7.1 P6.6 R25.2 R31.1 U9.4
KOND: J7.4 P6.3 R28.2 U9.1
TEMP: J7.5 P6.2 R26.2 U9.7
V1: J7.2 J13.2 P6.5 P12.1
V2: J7.3 P6.4 R27.2
VCC1: C19.1 J7.6 J12.2 P6.1 P13.1 R30.2 U9.8
Vref: R24.1 R29.1 R30.1 R31.2
NetJ11_2: J11.2 P11.5 ; port V1
NetJ11_3: J11.3 P11.4 ; port V2
NetJ11_4: J11.4 P11.3 ; port KOND
NetJ11_5: J11.5 P11.2 ; port TEMP
NetJ12_1: J12.1 P13.2 R25.1 U9.5
NetJ13_1: J13.1 P12.2 R27.1 R27.3 U9.3
NetR24_2: R24.2 R26.1 R26.3 U9.6
NetR28_1: R28.1 R28.3 R29.2 U9.2

Not connected (* = marked no-connect by the designer): J11 6; P11 1; R25 3

### Library data of the parts
C19 = Cap: Capacitor; Published: 8-Jun-2000; LatestRevisionDate: 17-Jul-2002; LatestRevisionNote: Re-released for DXP Platform.; PackageReference: RAD-0.3; Publisher: Altium Limited; PackageDescription: Radial Cap, Thru-Hole; 2 Leads; 0.3 in Pin Spacing
J7 J11 = B6B-PH-K-S(LF)(SN): CONN HEADER PH TOP 6POS 2MM; Manufacturer: JST Sales America Inc.; Pitch: 0.079" (2.00mm); Number Of Positions: 6; Part Number: B6B-PH-K-S(LF)(SN); PartId: 29452; Supplier 1: Digi-Key; Supplier Part Number 1: 455-1708-ND; ComponentLink1Description: Datasheet; ComponentLink1URL: http://www.jst-mfg.com/product/pdf/eng/ePH.pdf; ComponentLink2Description: Digi-Key Listing; ComponentLink2URL: http://www.digikey.com/product-detail/en/jst-sales-america-inc/B6B-PH-K-S(LF)(SN)/455-1708-ND/926615; Price: 0,33; Type: Header, Shrouded; Contact Finish: Tin; Fastening Type: Detent Lock; Number Of Rows: 1; Series: PH
J12 J13 = B2B-PH-K-S(LF)(SN): as J5 on sheet Sensors; Part Number: B2B-PH-K-S(LF)(SN); PartId: 29447; Supplier 1: Digi-Key; Supplier Part Number 1: 455-1704-ND; ComponentLink1Description: Datasheet; ComponentLink1URL: http://www.jst-mfg.com/product/pdf/eng/ePH.pdf; ComponentLink2Description: Digi-Key Listing; ComponentLink2URL: http://www.digikey.com/product-detail/en/jst-sales-america-inc/B2B-PH-K-S(LF)(SN)/455-1704-ND/926611; Price: 0,17; Type: Header, Shrouded; Contact Finish: Tin; Fastening Type: Detent Lock; Number Of Rows: 1; Series: PH
P6 P11 = Header 6H: Header, 6-Pin, Right Angle; LatestRevisionDate: 17-Jul-2002; LatestRevisionNote: Re-released for DXP Platform.; Publisher: Altium Limited
P12 P13 = Header 2: Header, 2-Pin; LatestRevisionDate: 17-Jul-2002; LatestRevisionNote: Re-released for DXP Platform.; Publisher: Altium Limited
R24 R29-R31 = Resistor: Tolerance: 1%; Power Rating: 1/4W; Package: 0602

## Nets that join several sheets
GND: Main Schematic (53 pins), Sensors (10 pins), Power (32 pins), Opamp (J11.1 P11.6)
3.3V: Main Schematic (14 pins), Power (6 pins)
~{EN}: Main Schematic (5 pins), Power (C21.1 R1.1 U2.5 U10.1)
AD1: Main Schematic (U7.37), Sensors (5 pins)
AD2: Main Schematic (U7.38), Sensors (R20.2 R21.1)
AD3: Main Schematic (U7.39), Sensors (R32.2 R33.1)
AD4: Main Schematic (U7.40), Sensors (6 pins)
IO5: Main Schematic (U7.31), Sensors (J5.2 P4.1)
IO6: Main Schematic (U7.27), Sensors (R22.2)
VCC_PH_TURB: Main Schematic (U5.1), Sensors (J3.2 J4.2 P1.2 P2.2)
VCC_SENSORS: Main Schematic (U4.1), Sensors (J2.2 J6.2 P3.2 P5.1)
VSTOR: Main Schematic (C22.1 D1.2), Power (9 pins)